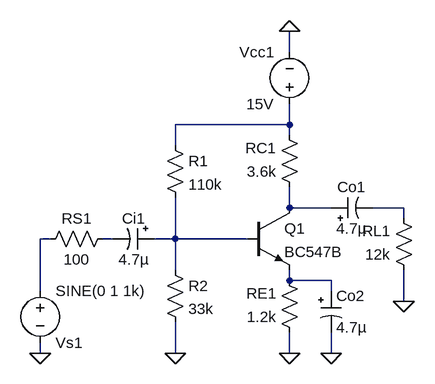
[diagram p0: schematic lab4.1f.asc]
lab4.1f.asc, the LTspice schematic file:
Version 4
SHEET 1 880 680
WIRE 240 -160 240 -192
WIRE 240 -48 240 -80
WIRE 240 -48 64 -48
WIRE 240 -32 240 -48
WIRE 64 -16 64 -48
WIRE 240 80 240 48
WIRE 304 80 240 80
WIRE 416 80 368 80
WIRE 416 96 416 80
WIRE -128 128 -144 128
WIRE -32 128 -48 128
WIRE 64 128 64 64
WIRE 64 128 32 128
WIRE 176 128 64 128
WIRE 64 176 64 128
WIRE 240 192 240 176
WIRE 304 192 240 192
WIRE -144 208 -144 128
WIRE 304 208 304 192
WIRE 416 224 416 176
WIRE -144 304 -144 288
WIRE 64 304 64 256
WIRE 240 304 240 272
WIRE 304 304 304 272
FLAG 240 304 0
FLAG 240 -192 0
FLAG 64 304 0
FLAG -144 304 0
FLAG 416 224 0
FLAG 304 304 0
SYMBOL res 256 64 R180
WINDOW 0 36 76 Left 2
WINDOW 3 36 40 Left 2
SYMATTR InstName RC1
SYMATTR Value 3.6k
SYMBOL res 256 288 R180
WINDOW 0 36 76 Left 2
WINDOW 3 36 40 Left 2
SYMATTR InstName RE1
SYMATTR Value 1.2k
SYMBOL npn 176 80 R0
SYMATTR InstName Q1
SYMATTR Value BC547B
SYMBOL voltage 240 -64 R180
WINDOW 0 24 96 Left 2
WINDOW 3 24 16 Left 2
WINDOW 123 0 0 Left 0
WINDOW 39 0 0 Left 0
SYMATTR InstName Vcc1
SYMATTR Value 15V
SYMBOL res 48 -32 R0
SYMATTR InstName R1
SYMATTR Value 110k
SYMBOL res 48 160 R0
SYMATTR InstName R2
SYMATTR Value 33k
SYMBOL res -32 112 R90
WINDOW 0 0 56 VBottom 2
WINDOW 3 32 56 VTop 2
SYMATTR InstName RS1
SYMATTR Value 100
SYMBOL res 432 192 R180
WINDOW 0 36 76 Left 2
WINDOW 3 36 40 Left 2
SYMATTR InstName RL1
SYMATTR Value 12k
SYMBOL polcap 32 112 R90
WINDOW 0 0 32 VBottom 2
WINDOW 3 32 32 VTop 2
SYMATTR InstName Ci1
SYMATTR Value 4.7µ
SYMATTR Description Capacitor
SYMATTR Type cap
SYMATTR SpiceLine V=50 Irms=30m Rser=4.7 Lser=0 mfg="Nichicon" pn="UPR1H4R7MAH" type="Al electrolytic"
SYMBOL voltage -144 192 R0
WINDOW 0 24 96 Left 2
WINDOW 3 24 16 Left 2
WINDOW 123 0 0 Left 0
WINDOW 39 0 0 Left 0
SYMATTR InstName Vs1
SYMATTR Value SINE(0 1 1k)
SYMBOL polcap 304 96 R270
WINDOW 0 32 32 VTop 2
WINDOW 3 0 32 VBottom 2
SYMATTR InstName Co1
SYMATTR Value 4.7µ
SYMATTR Description Capacitor
SYMATTR Type cap
SYMATTR SpiceLine V=50 Irms=30m Rser=4.7 Lser=0 mfg="Nichicon" pn="UPR1H4R7MAH" type="Al electrolytic"
SYMBOL polcap 288 208 R0
SYMATTR InstName Co2
SYMATTR Value 4.7µ
SYMATTR Description Capacitor
SYMATTR Type cap
SYMATTR SpiceLine V=50 Irms=30m Rser=4.7 Lser=0 mfg="Nichicon" pn="UPR1H4R7MAH" type="Al electrolytic"

The netlist it stands for:
* lab4.1f.asc
RC1 N002 N001 3.6k
RE1 0 N007 1.2k
Q1 N002 N006 N007 0 BC547B
Vcc1 N001 0 15V
R1 N001 N006 110k
R2 N006 0 33k
RS1 N005 N004 100
RL1 0 N003 12k
Ci1 N006 N005 4.7µ V=50 Irms=30m Rser=4.7 Lser=0 mfg="Nichicon" pn="UPR1H4R7MAH" type="Al electrolytic"
Vs1 N004 0 SINE(0 1 1k)
Co1 N002 N003 4.7µ V=50 Irms=30m Rser=4.7 Lser=0 mfg="Nichicon" pn="UPR1H4R7MAH" type="Al electrolytic"
Co2 N007 0 4.7µ V=50 Irms=30m Rser=4.7 Lser=0 mfg="Nichicon" pn="UPR1H4R7MAH" type="Al electrolytic"
.model NPN NPN
.model PNP PNP
.lib standard.bjt
.backanno
.end